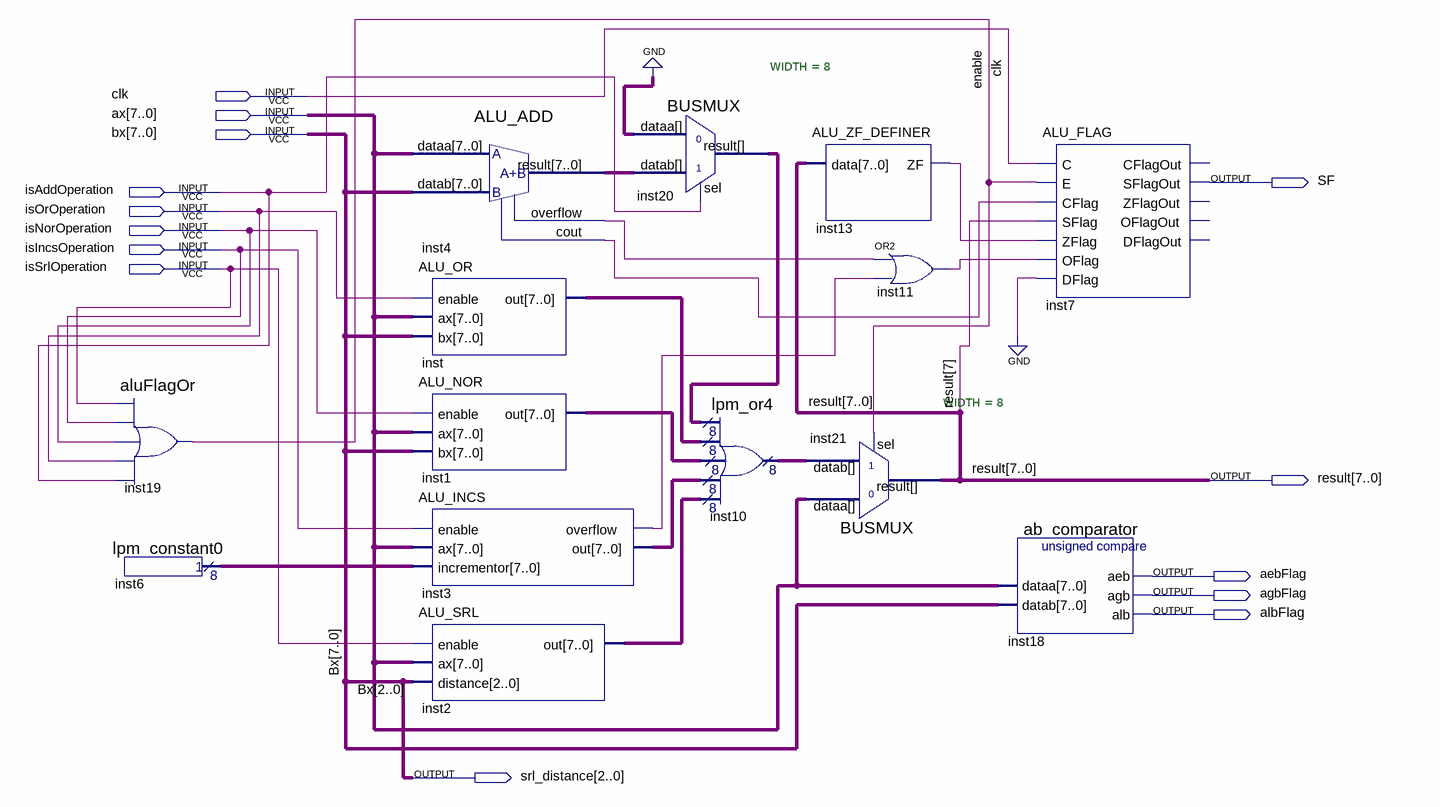
[diagram p0: schematic sheet]
// Quartus schematic ALU_BLOCK.bdf as structural Verilog: 14 symbols, 14 pins
module ALU_BLOCK (
  input  clk,
  input  [7:0] ax,
  input  [7:0] bx,
  input  isAddOperation,
  input  isOrOperation,
  input  isNorOperation,
  input  isIncsOperation,
  input  isSrlOperation,
  output SF,
  output [7:0] result,
  output aebFlag,
  output agbFlag,
  output albFlag,
  output [2:0] srl_distance
);

  wire enable, inst3_overflow, inst4_cout, inst4_overflow, inst11_out, inst13_zf;
  wire [7:0] inst1_out, inst2_out, inst3_out, inst4_result, inst6_result, inst10_result, inst20_result,
       inst_out;

  aluFlagOr inst19 (
    .data0(isSrlOperation), .data1(isIncsOperation), .data2(isNorOperation), .data3(isOrOperation),
    .data4(isAddOperation), .result(enable));
  lpm_constant0 inst6 (.result(inst6_result));
  ALU_ADD inst4 (.dataa(ax), .datab(bx), .result(inst4_result), .overflow(inst4_overflow), .cout(inst4_cout));
  ALU_OR inst (.enable(isOrOperation), .ax(ax), .bx(bx), .out(inst_out));
  ALU_NOR inst1 (.enable(isNorOperation), .ax(ax), .bx(bx), .out(inst1_out));
  ALU_INCS inst3 (
    .enable(isIncsOperation), .ax(ax), .incrementor(inst6_result), .overflow(inst3_overflow), .out(inst3_out));
  ALU_SRL inst2 (.enable(isSrlOperation), .ax(ax), .distance(bx[2:0]), .out(inst2_out));
  BUSMUX #(.WIDTH(8)) inst20 (.datab(inst4_result), .sel(isAddOperation), .dataa({8{1'b0}}), .result(inst20_result));
  lpm_or4 inst10 (
    .data0x(inst20_result), .data1x(inst_out), .data2x(inst1_out), .data3x(inst3_out), .data4x(inst2_out),
    .result(inst10_result));
  ALU_ZF_DEFINER inst13 (.data(result), .ZF(inst13_zf));
  BUSMUX #(.WIDTH(8)) inst21 (.datab(inst10_result), .sel(enable), .dataa(ax), .result(result));
  or inst11 (inst11_out, inst4_overflow, inst3_overflow);
  ALU_FLAG inst7 (
    .C(clk), .E(enable), .CFlag(inst4_cout), .SFlag(result[7]), .ZFlag(inst13_zf), .OFlag(inst11_out),
    .DFlag(1'b0), .SFlagOut(SF));  // open: CFlagOut, ZFlagOut, OFlagOut, DFlagOut
  ab_comparator inst18 (.dataa(ax), .datab(bx), .aeb(aebFlag), .agb(agbFlag), .alb(albFlag));

  assign srl_distance = bx[2:0];
endmodule
